# EAGLE design charger (EAGLE 9.4.2)
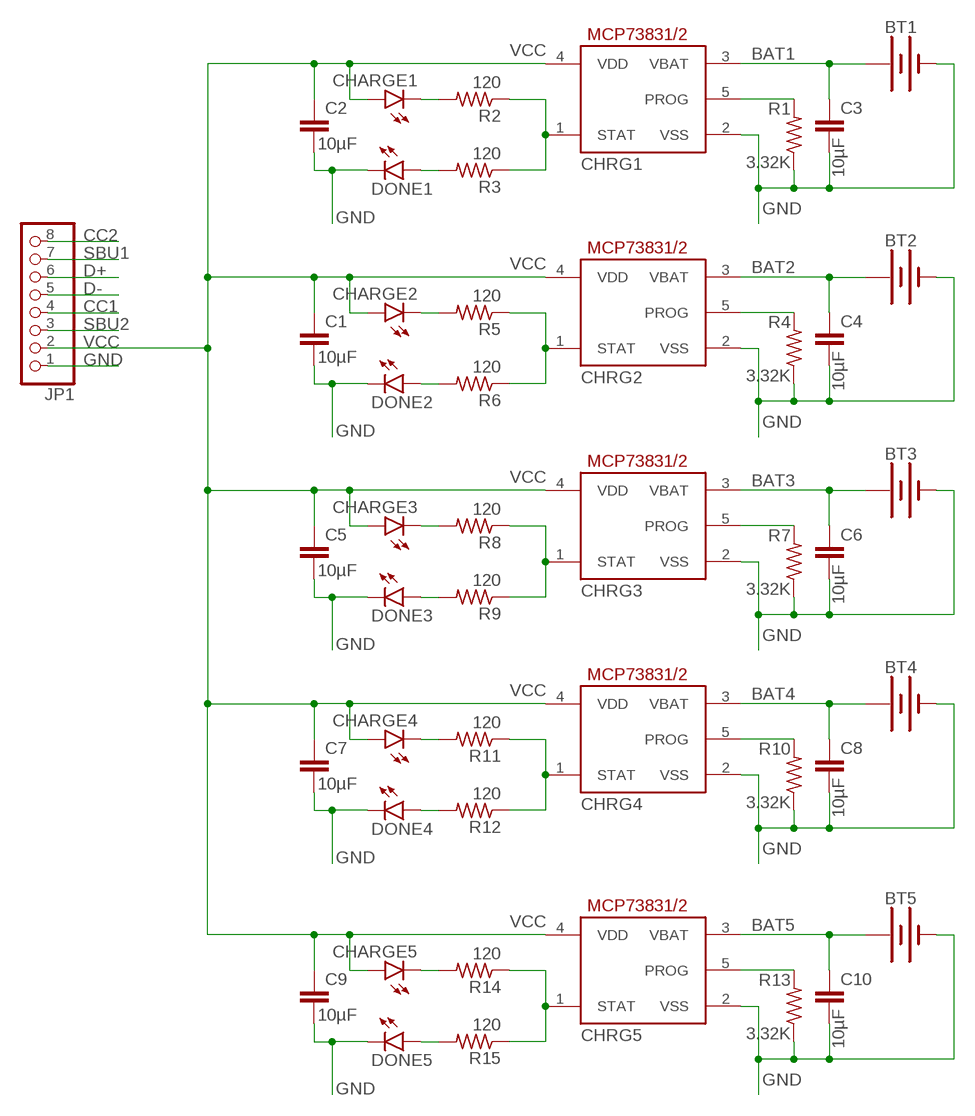
[diagram p0: schematic, sheet 1]

## Parts
BT1  BATTERY-18650  [BATTERY_18650-HOLDER]
BT2  BATTERY-18650  [BATTERY_18650-HOLDER]
BT3  BATTERY-18650  [BATTERY_18650-HOLDER]
BT4  BATTERY-18650  [BATTERY_18650-HOLDER]
BT5  BATTERY-18650  [BATTERY_18650-HOLDER]
C1  10µF  C-EUC1206  [C1206]
C2  10µF  C-EUC1206  [C1206]
C3  10µF  C-EUC1206  [C1206]
C4  10µF  C-EUC1206  [C1206]
C5  10µF  C-EUC1206  [C1206]
C6  10µF  C-EUC1206  [C1206]
C7  10µF  C-EUC1206  [C1206]
C8  10µF  C-EUC1206  [C1206]
C9  10µF  C-EUC1206  [C1206]
C10  10µF  C-EUC1206  [C1206]
CHARGE1  LED3MM  [LED3MM]
CHARGE2  LED3MM  [LED3MM]
CHARGE3  LED3MM  [LED3MM]
CHARGE4  LED3MM  [LED3MM]
CHARGE5  LED3MM  [LED3MM]
CHRG1  MCP73831/OT  [SOT23-5L]
CHRG2  MCP73831/OT  [SOT23-5L]
CHRG3  MCP73831/OT  [SOT23-5L]
CHRG4  MCP73831/OT  [SOT23-5L]
CHRG5  MCP73831/OT  [SOT23-5L]
DONE1  LED3MM  [LED3MM]
DONE2  LED3MM  [LED3MM]
DONE3  LED3MM  [LED3MM]
DONE4  LED3MM  [LED3MM]
DONE5  LED3MM  [LED3MM]
JP1  PINHD-1X8CLEANBIG  [1X08-CLEANBIG]
R1  3.32K  R-US_R1206  [R1206]
R2  120  R-US_R1206  [R1206]
R3  120  R-US_R1206  [R1206]
R4  3.32K  R-US_R1206  [R1206]
R5  120  R-US_R1206  [R1206]
R6  120  R-US_R1206  [R1206]
R7  3.32K  R-US_R1206  [R1206]
R8  120  R-US_R1206  [R1206]
R9  120  R-US_R1206  [R1206]
R10  3.32K  R-US_R1206  [R1206]
R11  120  R-US_R1206  [R1206]
R12  120  R-US_R1206  [R1206]
R13  3.32K  R-US_R1206  [R1206]
R14  120  R-US_R1206  [R1206]
R15  120  R-US_R1206  [R1206]

## Nets
BAT1: BT1.PWR@1(+) BT1.PWR@2(+) BT1.PWR@3(+) C3.1 CHRG1.3(VBAT)
BAT2: BT2.PWR@1(+) BT2.PWR@2(+) BT2.PWR@3(+) C4.1 CHRG2.3(VBAT)
BAT3: BT3.PWR@1(+) BT3.PWR@2(+) BT3.PWR@3(+) C6.1 CHRG3.3(VBAT)
BAT4: BT4.PWR@1(+) BT4.PWR@2(+) BT4.PWR@3(+) C8.1 CHRG4.3(VBAT)
BAT5: BT5.PWR@1(+) BT5.PWR@2(+) BT5.PWR@3(+) C10.1 CHRG5.3(VBAT)
CC1: JP1.4
CC2: JP1.8
D+: JP1.6
D-: JP1.5
GND: BT1.GND@1(-) BT1.GND@2(-) BT1.GND@3(-) BT2.GND@1(-) BT2.GND@2(-) BT2.GND@3(-) BT3.GND@1(-) BT3.GND@2(-) BT3.GND@3(-) BT4.GND@1(-) BT4.GND@2(-) BT4.GND@3(-) BT5.GND@1(-) BT5.GND@2(-) BT5.GND@3(-) C1.2 C2.2 C3.2 C4.2 C5.2 C6.2 C7.2 C8.2 C9.2 C10.2 CHRG1.2(VSS) CHRG2.2(VSS) CHRG3.2(VSS) CHRG4.2(VSS) CHRG5.2(VSS) DONE1.K(C) DONE2.K(C) DONE3.K(C) DONE4.K(C) DONE5.K(C) JP1.1 R1.1 R4.1 R7.1 R10.1 R13.1
N$1: DONE1.A R3.2
N$2: CHRG1.1(STAT) R2.1 R3.1
N$3: CHARGE2.K(C) R5.2
N$4: DONE2.A R6.2
N$5: CHRG2.1(STAT) R5.1 R6.1
N$6: CHRG2.5(PROG) R4.2
N$7: CHARGE1.K(C) R2.2
N$8: CHARGE3.K(C) R8.2
N$9: DONE3.A R9.2
N$10: CHRG1.5(PROG) R1.2
N$11: CHRG3.1(STAT) R8.1 R9.1
N$12: CHRG3.5(PROG) R7.2
N$13: CHARGE4.K(C) R11.2
N$14: DONE4.A R12.2
N$15: CHRG4.1(STAT) R11.1 R12.1
N$16: CHRG4.5(PROG) R10.2
N$17: CHARGE5.K(C) R14.2
N$18: DONE5.A R15.2
N$19: CHRG5.1(STAT) R14.1 R15.1
N$20: CHRG5.5(PROG) R13.2
SBU1: JP1.7
SBU2: JP1.3
VCC: C1.1 C2.1 C5.1 C7.1 C9.1 CHARGE1.A CHARGE2.A CHARGE3.A CHARGE4.A CHARGE5.A CHRG1.4(VDD) CHRG2.4(VDD) CHRG3.4(VDD) CHRG4.4(VDD) CHRG5.4(VDD) JP1.2

## Library data of the parts
BT1-BT5 = SparkFun-Batteries:BATTERY: Battery - Single Cell A variety of battery chemistries, sizes, and footprints. Device List: 20MM_PTH - Coin Cell Battery Holder - 20mm (PTH) <https://www.sparkfun.com/products/783> 6.8MM_PTH - Coin Cell Battery Holder - 6.8MM(SMD) <https://www.digikey.com/product-detail/en/seiko-instruments/MS621FE-FL11E/728-1057-ND/1889208?WT.srch=1&gclid=CNOQ5a6LzdQCFZS2wAodXCkE0g> 12MM_SMD - Coin Cell Battery Holder - 12mm (SMD) <https://www.sparkfun.com/products/10592> 12MM_PTH - Coin Cell Battery Holder - 12mm (PTH) <https://www.sparkfun.com/products/7948> 20MM_SMD - 20mm Coin Cell Battery Holder (SMD) (2 legs) Used on the Big Time Watch Kit <https://www.sparkfun.com/products/11734> 20MM_SMD_4LEGS - Coin Cell Battery Holder - 20mm (SMD) <https://www.sparkfun.com/products/11892> 20MM_SMD_4LEGS_OVERPASTE - Coin Cell Battery Holder - 20mm (SMD) <https://www.sparkfun.com/products/11892> (Over-paste on the legs) 24.5MM_PTH - Coin Cell Battery Holder - 24.5mm (PTH) <https://www.sparkfun.com/products/8863> 9V - 9V Battery Holder - PC Mount Used on the SparkFun SparkPunk Sound Kit <https://www.sparkfun.com/products/11177> and SparkFun SparkPunk Sequencer Kit <https://www.sparkfun.com/products/12707> 18650 - Battery Holder - 18650 (PTH) <https://www.sparkfun.com/products/13113> AA - Battery Holder - 1xAA (PTH) <https://www.sparkfun.com/products/7949> AAA - Battery Holder - 1xAAA (PTH) <https://www.sparkfun.com/products/12718> AA_KIT - Battery Holder - 1xAA (PTH) <https://www.sparkfun.com/products/7949> Special kit package - pads only have exposed copper on one side of the board. AAA_KIT - Battery Holder - 1xAAA (PTH) <https://www.sparkfun.com/products/12718> Special kit package - pads only have exposed copper on one side of the board.; PROD_ID: BATT-12327; SF_SKU: PRT-13113
C1-C10 = rcl:C-EU: CAPACITOR, European symbol; SPICEPREFIX: C
CHARGE1-CHARGE5 DONE1-DONE5 = led:LED: LED OSRAM: - CHIPLED LG R971, LG N971, LY N971, LG Q971, LY Q971, LO R971, LY R971 LH N974, LH R974 LS Q976, LO Q976, LY Q976 LO Q996 - Hyper CHIPLED LW Q18S LB Q993, LB Q99A, LB R99A - SideLED LS A670, LO A670, LY A670, LG A670, LP A670 LB A673, LV A673, LT A673, LW A673 LH A674 LY A675 LS A676, LA A676, LO A676, LY A676, LW A676 LS A679, LY A679, LG A679 - Hyper Micro SIDELED® LS Y876, LA Y876, LO Y876, LY Y876 LT Y87S - SmartLED LW L88C, LW L88S LB L89C, LB L89S, LG L890 LS L89K, LO L89K, LY L89K LS L896, LA L896, LO L896, LY L896 - TOPLED LS T670, LO T670, LY T670, LG T670, LP T670 LSG T670, LSP T670, LSY T670, LOP T670, LYG T670 LG T671, LOG T671, LSG T671 LB T673, LV T673, LT T673, LW T673 LH T674 LS T676, LA T676, LO T676, LY T676, LB T676, LH T676, LSB T676, LW T676 LB T67C, LV T67C, LT T67C, LS T67K, LO T67K, LY T67K, LW E67C LS E67B, LA E67B, LO E67B, LY E67B, LB E67C, LV E67C, LT E67C LW T67C LS T679, LY T679, LG T679 LS T770, LO T770, LY T770, LG T770, LP T770 LB T773, LV T773, LT T773, LW T773 LH T774 LS E675, LA E675, LY E675, LS T675 LS T776, LA T776, LO T776, LY T776, LB T776 LHGB T686 LT T68C, LB T68C - Hyper Mini TOPLED® LB M676 - Mini TOPLED Santana® LG M470 LS M47K, LO M47K, LY M47K Source: http://www.osram.convergy.de LUXEON: - LUMILED® LXK2-PW12-R00, LXK2-PW12-S00, LXK2-PW14-U00, LXK2-PW14-V00 LXK2-PM12-R00, LXK2-PM12-S00, LXK2-PM14-U00 LXK2-PE12-Q00, LXK2-PE12-R00, LXK2-PE12-S00, LXK2-PE14-T00, LXK2-PE14-U00 LXK2-PB12-K00, LXK2-PB12-L00, LXK2-PB12-M00, LXK2-PB14-N00, LXK2-PB14-P00, LXK2-PB14-Q00 LXK2-PR12-L00, LXK2-PR12-M00, LXK2-PR14-Q00, LXK2-PR14-R00 LXK2-PD12-Q00, LXK2-PD12-R00, LXK2-PD12-S00 LXK2-PH12-R00, LXK2-PH12-S00 LXK2-PL12-P00, LXK2-PL12-Q00, LXK2-PL12-R00 Source: www.luxeon.com KINGBRIGHT: KA-3528ASYC Source: www.kingbright.com
CHRG1-CHRG5 = adafruit:MCP73831: MCP73831/2 Miniature Single-Cell, Fully Integrated Li-Ion, Li-Polymer Charge Management Controllers. Nice and small simple lipoly charge controller, with adjustable current and status output (LED) http://www.ladyada.net/library/pcb/eaglelibrary.html
JP1 = adafruit:PINHD-1X8: PIN HEADER
R1-R15 = rcl:R-US_: RESISTOR, American symbol; SPICEPREFIX: R

## Board
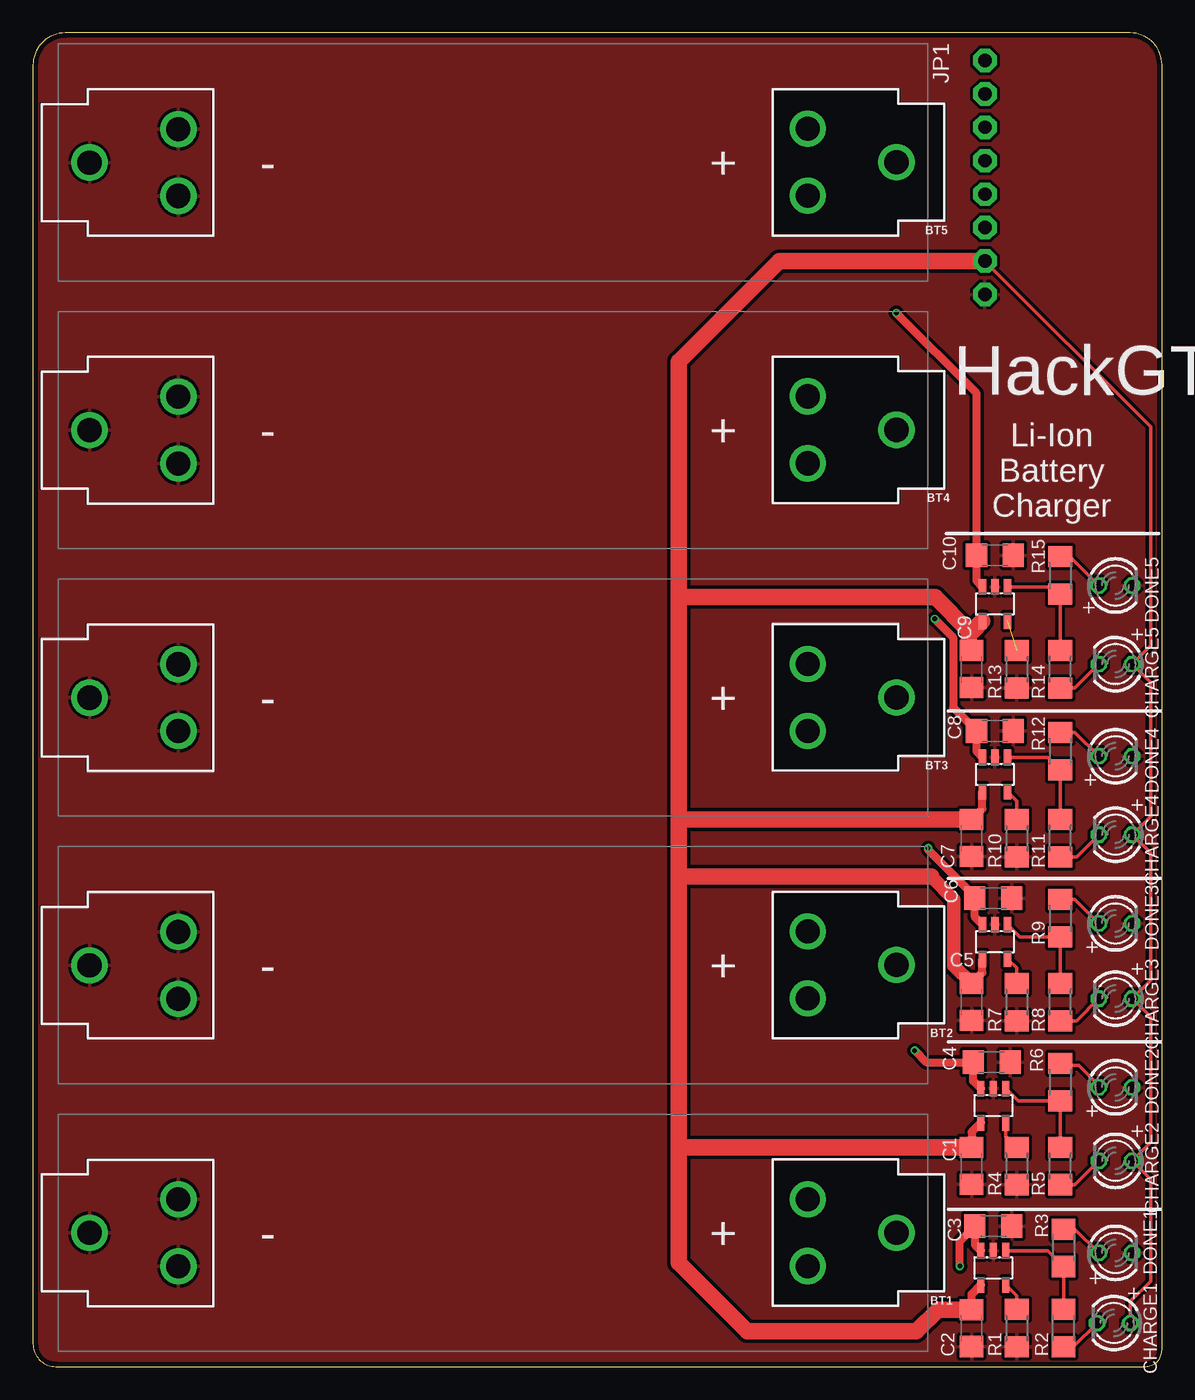
[diagram p1: board, top side]
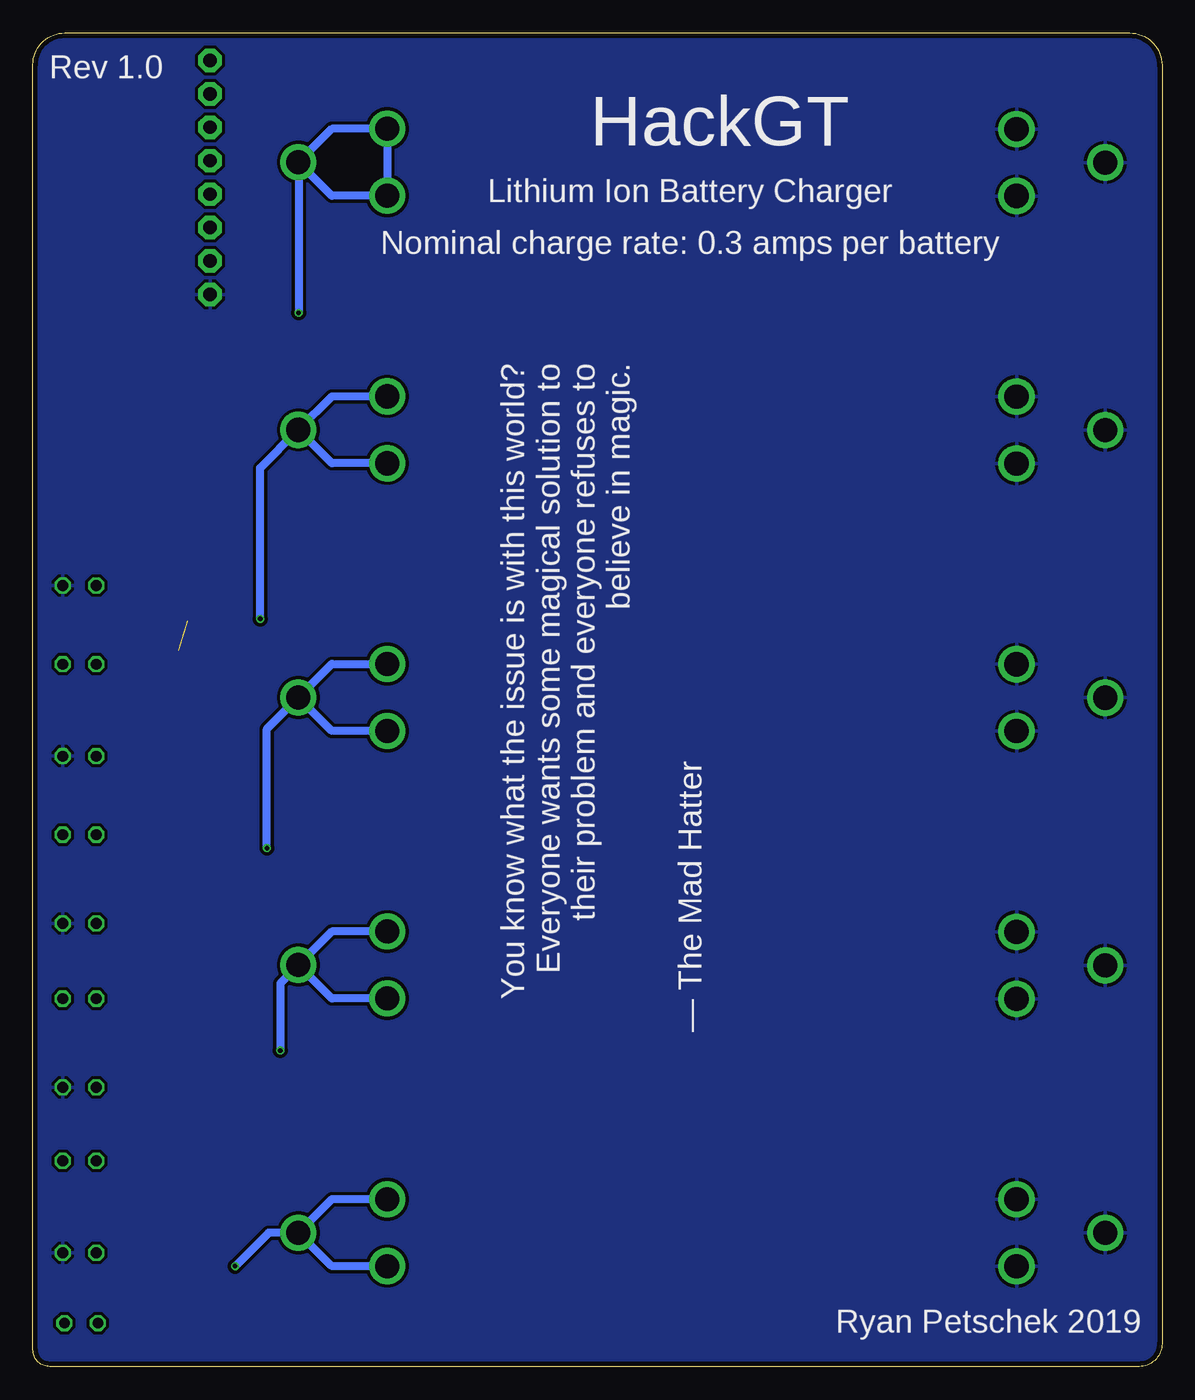
[diagram p2: board, bottom side, seen from below]

Size 85.7 x 101.27 mm. Coordinates in mm from the lower left corner, seen from the top.
Outline: 85.7,1.27 85.7,98.86 arc90 83.29,101.27 2.46,101.27 arc90 0,98.81 0,1.73 arc90 1.73,0 84.44,0 arc90 85.7,1.27
Copper layers (1*16): Top 0.035559375mm / dielectric 1.6mm / Bottom 0.035559375mm
Design rules "oshpark-2layer *": minimum track width 6mil, minimum drill 10mil, track to track 10mil, track to pad 6mil, pad to pad 6mil, via to via 6mil, smd to smd 6mil, copper to edge 15mil, drill to drill 6mil, minimum pad ring 5mil, minimum via ring 5mil, stop-mask expansion 2.5mil, vias tented up to drill 0mil, thermal gap 10mil

### Footprints (pad centres in the part's own frame; a part is rotated, then mirrored left to right if it is on the bottom)
BATTERY_18650-HOLDER = drill 1.829: GND@1 30.628,0.01; GND@2 23.88,2.55; GND@3 23.88,-2.53; PWR@1 -30.628,-0.01; PWR@2 -23.88,2.53; PWR@3 -23.88,-2.55
C1206 = smd 1.6 x 1.8: 1 -1.4,0; 2 1.4,0
LED3MM = drill 0.813 octagon: A -1.27,0; K 1.27,0
SOT23-5L = smd 0.55 x 1.2: 1 -0.95,-1.3; 2 0,-1.3; 3 0.95,-1.3; 4 0.95,1.3; 5 -0.95,1.3
1X08-CLEANBIG = drill 1.016 pad 1.778 octagon: 1 -8.89,0; 2 -6.35,0; 3 -3.81,0; 4 -1.27,0; 5 1.27,0; 6 3.81,0; 7 6.35,0; 8 8.89,0
R1206 = smd 1.6 x 1.803: 1 -1.422,0; 2 1.422,0

### Placement (x,y rotation side)
BT1  34.92,10.16 180 top
BT2  34.92,30.48 180 top
BT3  34.92,50.8 180 top
BT4  34.92,71.12 180 top
BT5  34.92,91.44 180 top
C1  71.25,15.24 270 top
C2  71.25,2.92 270 top
C3  72.9,10.67 0 top
C4  72.77,23.11 0 top
C5  71.25,27.69 270 top
C6  72.9,35.56 0 top
C7  71.25,40.13 270 top
C8  73.03,48.26 0 top
C9  71.25,52.96 270 top
C10  73.03,61.59 0 top
CHARGE1  82.04,3.3 180 top
CHARGE2  82.17,15.62 180 top
CHARGE3  82.17,27.94 180 top
CHARGE4  82.17,40.39 180 top
CHARGE5  82.17,53.34 180 top
CHRG1  72.9,7.49 180 top
CHRG2  72.9,19.81 180 top
CHRG3  73.03,32.26 180 top
CHRG4  73.03,44.96 180 top
CHRG5  73.03,57.91 180 top
DONE1  82.17,8.64 0 top
DONE2  82.17,21.21 0 top
DONE3  82.17,33.66 0 top
DONE4  82.17,46.35 0 top
DONE5  82.17,59.31 0 top
JP1  72.26,90.3 90 top
R1  74.68,2.92 90 top
R2  78.23,2.92 270 top
R3  78.23,9.02 90 top
R4  74.68,15.24 90 top
R5  77.98,15.24 270 top
R6  77.98,21.59 90 top
R7  74.68,27.69 90 top
R8  77.98,27.69 270 top
R9  77.98,34.04 90 top
R10  74.68,40.13 90 top
R11  77.98,40.13 270 top
R12  77.98,46.74 90 top
R13  74.68,52.96 90 top
R14  77.98,52.96 270 top
R15  77.98,60.07 90 top

### Tracks (layer width: path | path; a pad name or v marks a point on that pad's centre or on a via)
BAT1  (via drill 0.35)
  Top 0.61: CHRG1.3 71.5,9.24 C3.1 70.36,9.53 v70.36,7.62
  Bottom 0.61: BT1.PWR@3 63.01,12.71 BT1.PWR@1 | BT1.PWR@2 63.01,7.63 BT1.PWR@1 | BT1.PWR@1 67.81,10.17 v70.36,7.62
BAT2  (via drill 0.35)
  Top 0.61: v66.93,24 67.82,23.11 C4.1 71.37,21.69 CHRG2.3
  Bottom 0.61: BT2.PWR@3 63.01,33.03 BT2.PWR@1 | BT2.PWR@2 63.01,27.95 BT2.PWR@1 | BT2.PWR@1 66.93,29.11 v66.93,24
BAT3  (via drill 0.35)
  Top 0.61: CHRG3.3 71.5,34.13 C6.1 71.5,35.69 67.95,39.24 v67.95,39.37
  Bottom 0.61: v67.95,39.37 67.95,48.42 BT3.PWR@1 | BT3.PWR@2 63.01,48.27 BT3.PWR@1 | BT3.PWR@1 63.01,53.35 BT3.PWR@3
BAT4  (via drill 0.35)
  Top 0.61: CHRG4.3 71.62,46.71 C8.1 69.85,50.04 69.85,55.38 v68.45,56.77
  Bottom 0.61: v68.45,56.77 68.45,68.23 BT4.PWR@1 | BT4.PWR@2 63.01,68.59 BT4.PWR@1 | BT4.PWR@3 63.01,73.67 BT4.PWR@1
BAT5  (via drill 0.35)
  Top 0.61: CHRG5.3 71.62,59.66 C10.1 71.62,73.92 v65.53,80.01
  Bottom 0.61: BT5.PWR@1 63.01,88.91 BT5.PWR@2 BT5.PWR@3 63.01,93.99 BT5.PWR@1 | v65.53,80.01 65.53,91.43 BT5.PWR@1
GND
  pour Top: -4.45,105.41 93.34,105.41 93.34,-3.81 -6.99,-3.81 -6.99,105.41
  pour Bottom: -4.45,105.41 93.34,105.41 93.34,-3.81 -6.99,-3.81 -6.99,105.41
N$1
  Top 0.254: R3.2 79.1,10.44 DONE1.A
N$2
  Top 0.254: CHRG1.1 77.03,8.79 R3.1 R2.1
N$3
  Top 0.254: R5.2 79.1,13.82 CHARGE2.K
N$4
  Top 0.254: R6.2 78.13,22.86 79.38,22.86 80.9,21.34 DONE2.A
N$5
  Top 0.254: CHRG2.1 74.79,20.17 R6.1 R5.1
N$6
  Top 0.254: CHRG2.5 73.85,17.49 R4.2
N$7
  Top 0.254: CHARGE1.K 78.97,1.5 R2.2
N$8
  Top 0.254: R8.2 79.22,26.26 CHARGE3.K
N$9
  Top 0.254: R9.2 79.1,35.46 DONE3.A
N$10
  Top 0.254: R1.2 74.68,5.37 CHRG1.5
N$11
  Top 0.254: CHRG3.1 74.92,32.61 R9.1 R8.1
N$12
  Top 0.254: CHRG3.5 74.68,30.26 R7.2
N$13
  Top 0.254: R11.2 79.22,38.71 CHARGE4.K
N$14
  Top 0.254: R12.2 79.1,48.16 DONE4.A
N$15
  Top 0.254: CHRG4.1 77.03,46.26 R12.1 R11.1
N$16
  Top 0.254: CHRG4.5 74.68,42.96 R10.2
N$17
  Top 0.254: R14.2 79.1,51.54 CHARGE5.K
N$18
  Top 0.254: R15.2 78.72,61.49 DONE5.A
N$19
  Top 0.254: CHRG5.1 77.42,59.21 R15.1 R14.1
N$20  (1 unrouted)
VCC
  Top 0.254: CHARGE1.A 83.31,4.95 84.84,6.48 84.84,14.22 CHARGE2.A 84.84,17.02 84.84,26.54 CHARGE3.A 84.84,29.34 84.84,38.99 CHARGE4.A 84.84,41.78 84.84,51.94 CHARGE5.A 84.84,54.74 84.84,71.37 JP1.2
  Top 0.61: C2.1 71.25,5.49 CHRG1.4 | CHRG2.4 71.25,17.81 C1.1 | 49.15,37.21 49.02,37.08 | C5.1 72.08,29.91 CHRG3.4 | C7.1 72.08,42.36 CHRG4.4
  Top 1.016: C5.1 69.91,30.42 69.91,35.47 68.17,37.21
  Top 1.27: C2.1 68.71,4.32 67.06,2.67 54.23,2.67 49.02,7.87 49.02,16.51 | JP1.2 56.64,83.95 49.02,76.33 49.02,58.42 | 49.02,58.42 49.02,41.91 | 49.02,41.91 49.02,37.08 49.02,16.51 | C1.1 49.15,16.64 49.02,16.51 | 68.17,37.21 49.15,37.21 | C7.1 49.4,41.53 49.02,41.91 | C9.1 71.04,54.56 71.04,55.87 | 71.04,55.87 68.49,58.42 49.02,58.42 | 71.04,55.87 71.33,55.87 CHRG5.4

### Text on the board
tNames: HackGT | Li-Ion / Battery / Charger | + | + | + | + | + | + | + | + | + | +
bNames: Rev 1.0 | HackGT | Lithium Ion Battery Charger | Nominal charge rate: 0.3 amps per battery | You know what the issue is with this world? / Everyone wants some magical solution to / their problem and everyone refuses to / believe in magic. | — The Mad Hatter | Ryan Petschek 2019